# EasyEDA schematic SCH_4-Digit-Counter_2024-08-14.json
TITLE: Sheet_1; REV: 1.0; Date: 2023-05-01; Sheet: 1/1; Company: Your Company
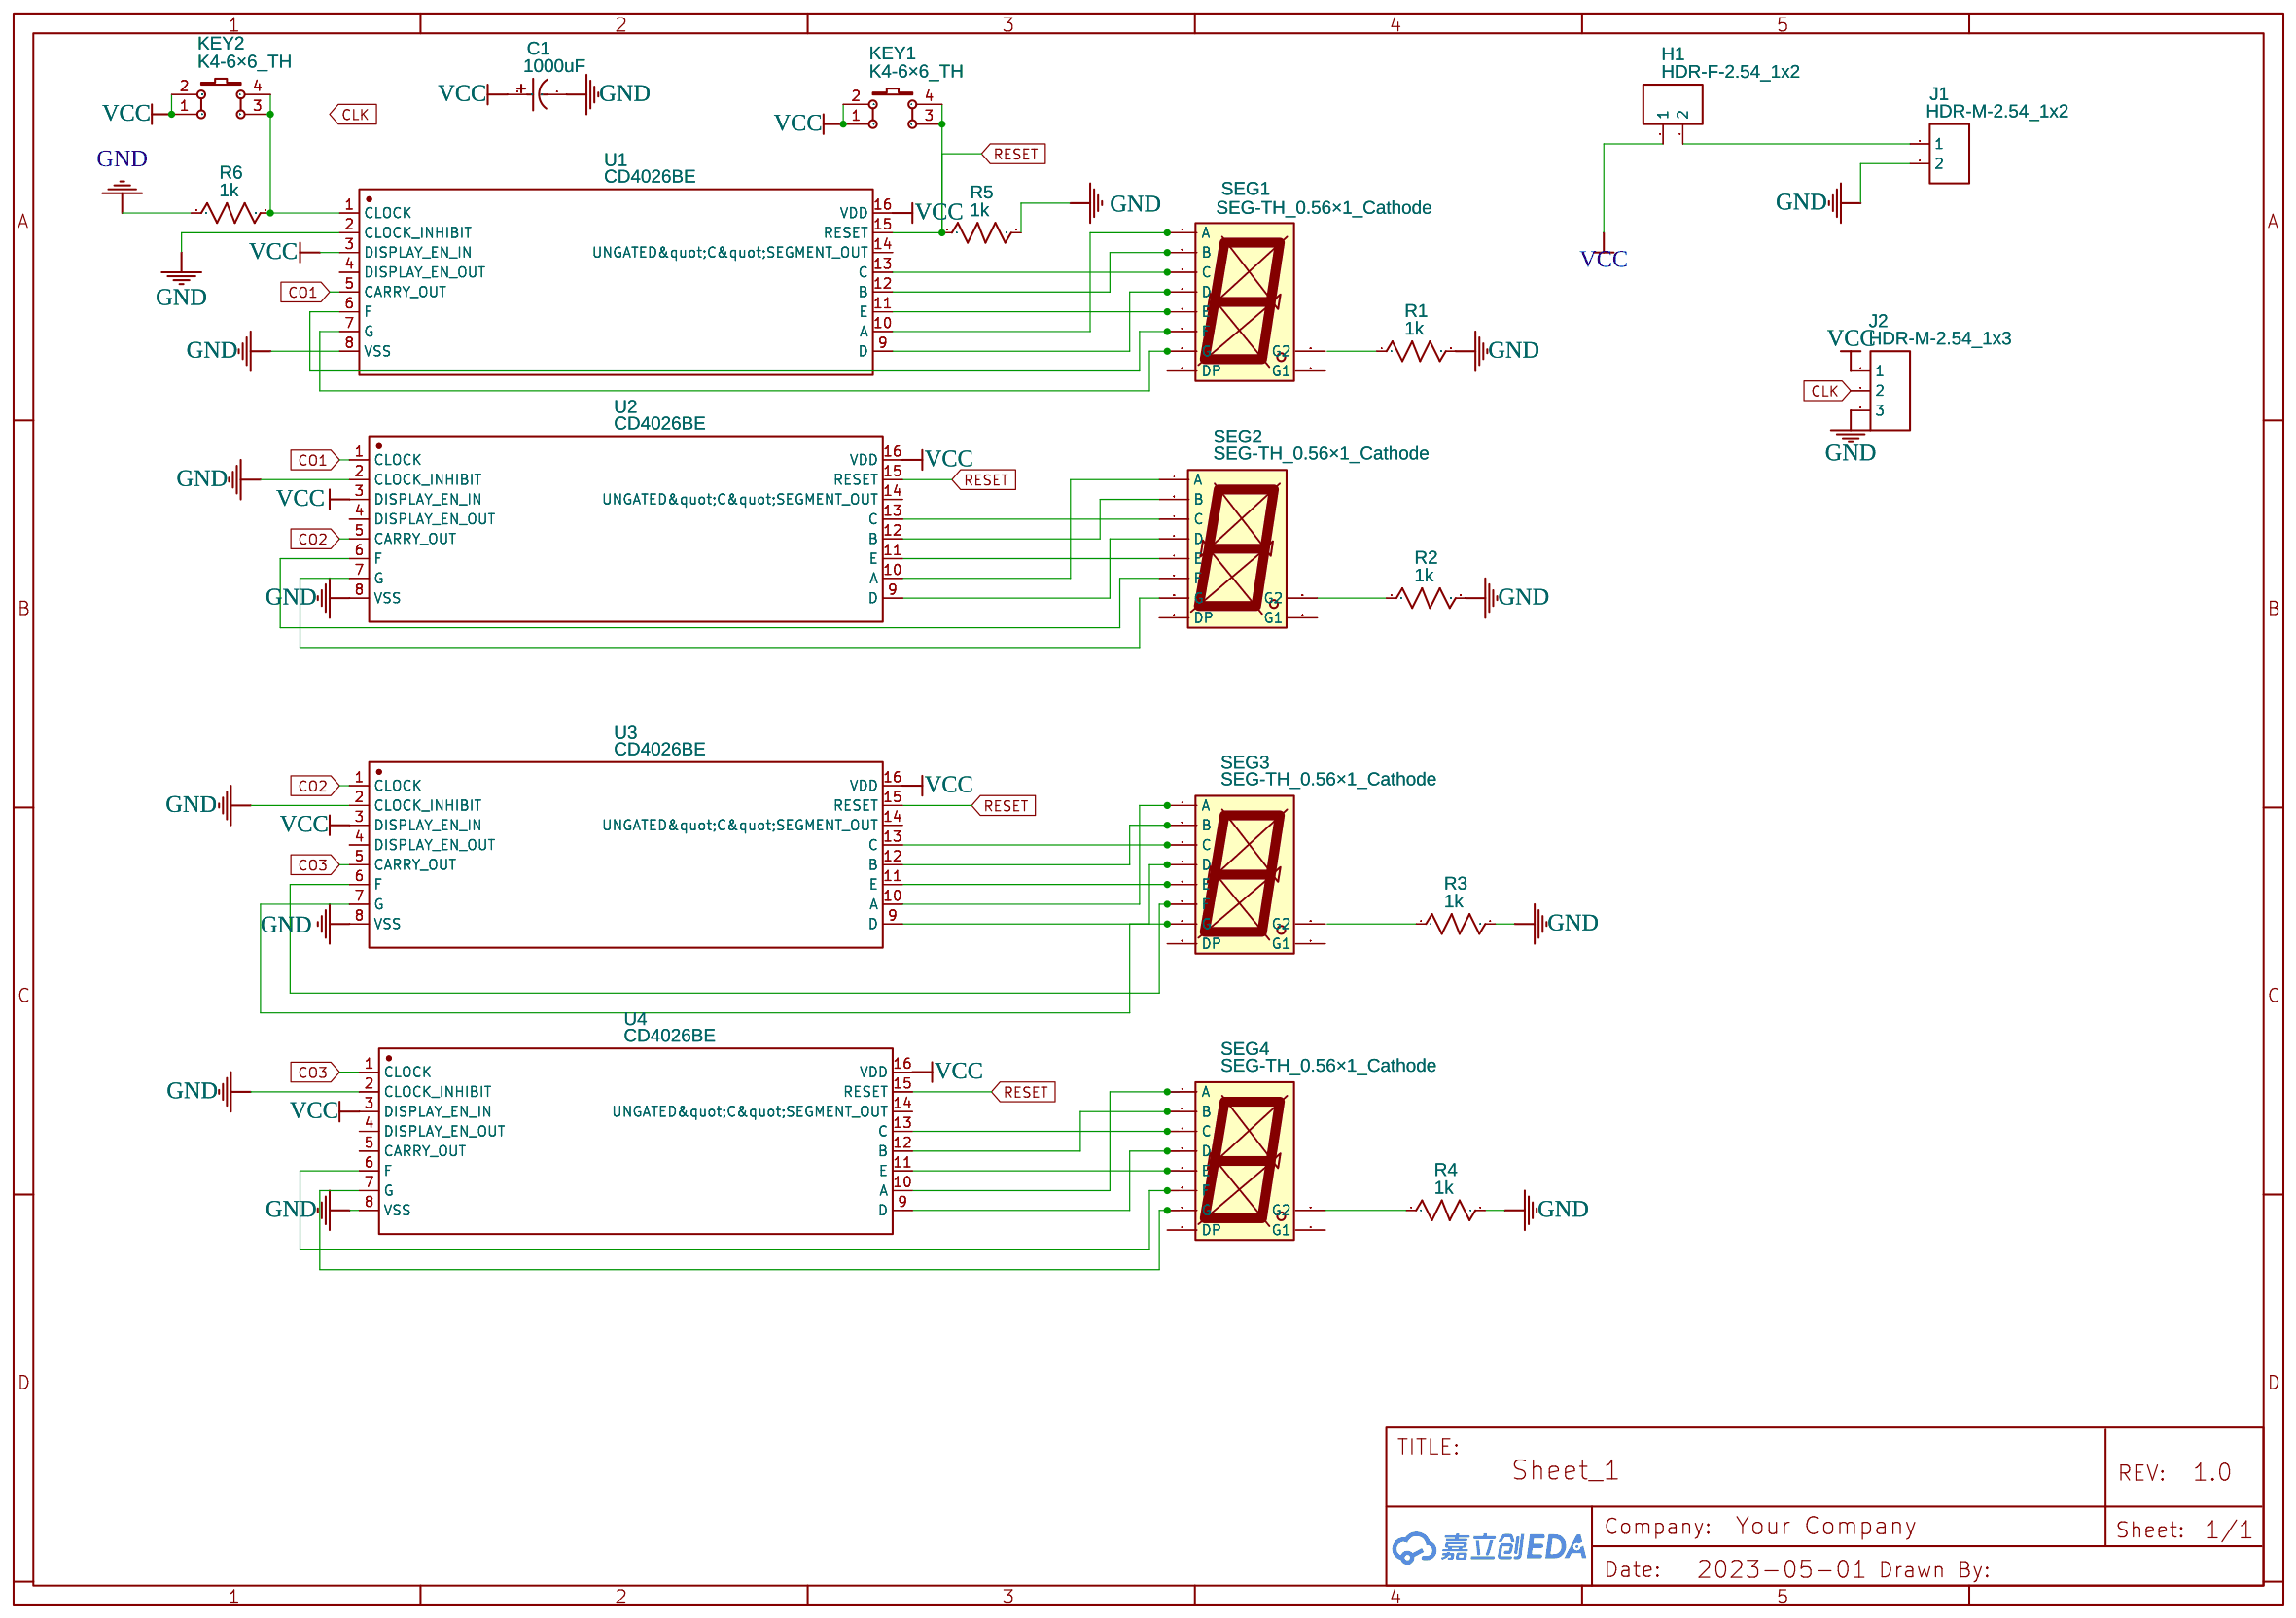
[diagram p0: schematic sheet]

## Parts
C1  1000uF  [CAP-TH_BD10.0-P5.00-D1.0-FD]
H1  HDR-F-2.54_1x2  [HDR-F-2.54_1X2]
J1  HDR-M-2.54_1x2  [HDR-M-2.54_1X2]
J2  HDR-M-2.54_1x3  [HDR-M-2.54_1X3]
KEY1  K4-6×6_TH  [KEY-TH_4P-L6.0-W6.0-P4.50-LS6.5]
KEY2  K4-6×6_TH  [KEY-TH_4P-L6.0-W6.0-P4.50-LS6.5]
R1  1k  [R_AXIAL-0.4]
R2  1k  [R_AXIAL-0.4]
R3  1k  [R_AXIAL-0.4]
R4  1k  [R_AXIAL-0.4]
R5  1k  [R_AXIAL-0.4]
R6  1k  [R_AXIAL-0.4]
SEG1  SEG-TH_0.56×1_Cathode  [LED-SEG-TH_10P-L12.6-W19.0-P2.54-S15.24-BL]
SEG2  SEG-TH_0.56×1_Cathode  [LED-SEG-TH_10P-L12.6-W19.0-P2.54-S15.24-BL]
SEG3  SEG-TH_0.56×1_Cathode  [LED-SEG-TH_10P-L12.6-W19.0-P2.54-S15.24-BL]
SEG4  SEG-TH_0.56×1_Cathode  [LED-SEG-TH_10P-L12.6-W19.0-P2.54-S15.24-BL]
U1  CD4026BE  [DIP-16_L19.3-W6.4-P2.54-LS7.6-BL]
U2  CD4026BE  [DIP-16_L19.3-W6.4-P2.54-LS7.6-BL]
U3  CD4026BE  [DIP-16_L19.3-W6.4-P2.54-LS7.6-BL]
U4  CD4026BE  [DIP-16_L19.3-W6.4-P2.54-LS7.6-BL]

## Library data of the parts
C1 = 1000uF 16V 10*13: Supplier: LCSC; Manufacturer: CX(承兴); Manufacturer Part: KM108M016G13RR0VH2FP0; Supplier Part: C43810; JLCPCB Part Class: Extended Part
H1 = HDR-F-2.54_1x2: Supplier Part: C49661; Supplier: LCSC; Contributor: LCEDA_Lib
J1 = HDR-M-2.54_1x2: Supplier Part: C124375; Supplier: LCSC; Contributor: LCEDA_Lib
J2 = HDR-M-2.54_1x3: Supplier Part: C180248; Supplier: LCSC; Contributor: LCEDA_Lib
KEY1 KEY2 = K4-6×6_TH: Supplier: LCSC; Supplier Part: C136684; Manufacturer: 韩国韩荣; Manufacturer Part: K2-1102DP-E4SW-04; Contributor: LCEDA_Lib
R1-R6 = R_AXIAL-0.4_US: Contributor: LCEDA_Lib
SEG1-SEG4 = SEG-TH_0.56×1_Cathode: Manufacturer: 志浩; Supplier Part: C8093; Contributor: LCEDA_01
U1-U4 = CD4026BE: Supplier: LCSC; Manufacturer: TI(德州仪器); Supplier Part: C89909; JLCPCB Part Class: Extended Part

## Nets
GND: C1.2 J1.2 J2.3 R1.2 R2.2 R3.2 R4.2 R5.2 R6.1 U1.2(CLOCK_INHIBIT) U1.8(VSS) U2.2(CLOCK_INHIBIT) U2.8(VSS) U3.2(CLOCK_INHIBIT) U3.8(VSS) U4.2(CLOCK_INHIBIT) U4.8(VSS)
VCC: C1.1 H1.1 J2.1 KEY1.1 KEY1.2 KEY2.1 KEY2.2 U1.3(DISPLAY_EN_IN) U1.16(VDD) U2.3(DISPLAY_EN_IN) U2.16(VDD) U3.3(DISPLAY_EN_IN) U3.16(VDD) U4.3(DISPLAY_EN_IN) U4.16(VDD)
CLK: J2.2
CO1: U1.5(CARRY_OUT) U2.1(CLOCK)
CO2: U2.5(CARRY_OUT) U3.1(CLOCK)
CO3: U3.5(CARRY_OUT) U4.1(CLOCK)
RESET: KEY1.3 KEY1.4 R5.1 U1.15(RESET) U2.15(RESET) U3.15(RESET) U4.15(RESET)
Net-(H1-2): H1.2 J1.1
Net-(KEY2-3): KEY2.3 KEY2.4 R6.2 U1.1(CLOCK)
Net-(R2-1): R2.1 SEG2.8(G2)
Net-(R4-1): R4.1 SEG4.8(G2)
Net-(SEG1-1): SEG1.1(E) U1.11(E)
Net-(SEG1-2): SEG1.2(D) U1.9(D)
Net-(SEG1-4): SEG1.4(C) U1.13(C)
Net-(SEG1-6): SEG1.6(B) U1.12(B)
Net-(SEG1-7): SEG1.7(A) U1.10(A)
Net-(SEG1-9): SEG1.9(F) U1.6(F)
Net-(SEG1-10): SEG1.10(G) U1.7(G)
Net-(SEG2-1): SEG2.1(E) U2.11(E)
Net-(SEG2-2): SEG2.2(D) U2.9(D)
Net-(SEG2-4): SEG2.4(C) U2.13(C)
Net-(SEG2-6): SEG2.6(B) U2.12(B)
Net-(SEG2-7): SEG2.7(A) U2.10(A)
Net-(SEG2-9): SEG2.9(F) U2.6(F)
Net-(SEG2-10): SEG2.10(G) U2.7(G)
Net-(SEG3-1): SEG3.1(E) U3.11(E)
Net-(SEG3-2): SEG3.2(D) U3.9(D)
Net-(SEG3-4): SEG3.4(C) U3.13(C)
Net-(SEG3-6): SEG3.6(B) U3.12(B)
Net-(SEG3-7): SEG3.7(A) U3.10(A)
Net-(SEG3-9): SEG3.9(F) U3.6(F)
Net-(SEG3-10): SEG3.10(G) U3.7(G)
Net-(SEG4-1): SEG4.1(E) U4.11(E)
Net-(SEG4-2): SEG4.2(D) U4.9(D)
Net-(SEG4-4): SEG4.4(C) U4.13(C)
Net-(SEG4-6): SEG4.6(B) U4.12(B)
Net-(SEG4-7): SEG4.7(A) U4.10(A)
Net-(SEG4-9): SEG4.9(F) U4.6(F)
Net-(SEG4-10): SEG4.10(G) U4.7(G)

Not connected (* = marked no-connect by the designer): R1 1; R3 1; SEG1 3(G1) 5(DP) 8(G2); SEG2 3(G1) 5(DP); SEG3 3(G1) 5(DP) 8(G2); SEG4 3(G1) 5(DP); U1 4(DISPLAY_EN_OUT) 14(UNGATED"C"SEGMENT_OUT); U2 4(DISPLAY_EN_OUT) 14(UNGATED"C"SEGMENT_OUT); U3 4(DISPLAY_EN_OUT) 14(UNGATED"C"SEGMENT_OUT); U4 4(DISPLAY_EN_OUT) 5(CARRY_OUT) 14(UNGATED"C"SEGMENT_OUT)
